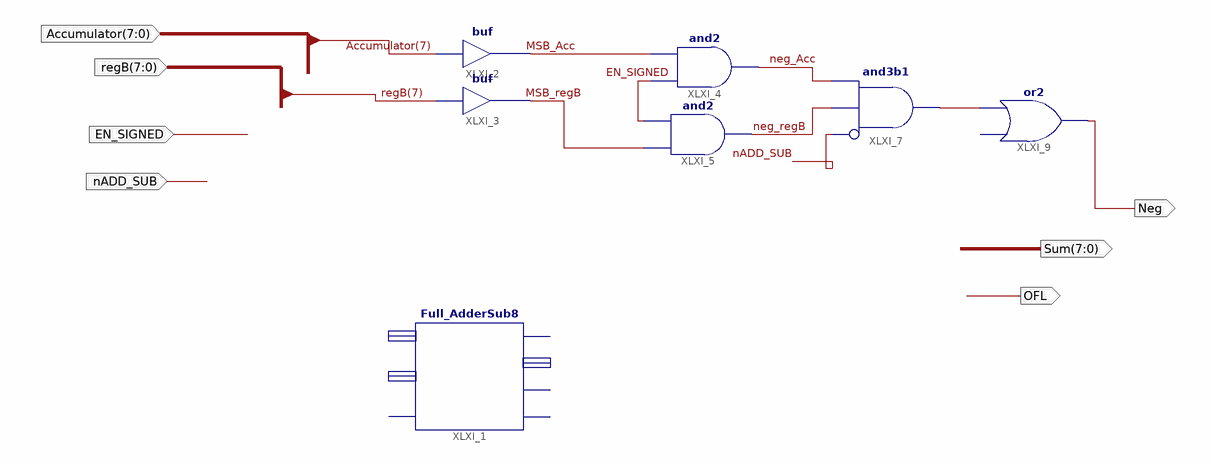
[diagram p0: schematic sheet 1]
// Xilinx ISE schematic ALU_Final.sch (spartan3e) as structural Verilog: 7 symbols, 7 ports
module ALU_Final (
  input  [7:0] Accumulator,
  input  [7:0] regB,
  input  EN_SIGNED,
  input  nADD_SUB,
  output [7:0] Sum,
  output Neg,
  output OFL
);

  wire MSB_Acc, MSB_regB, neg_Acc, neg_regB, XLXN_34;

  Full_AdderSub8 XLXI_1 ();  // open: Ain, Bin, nADD_SUB, Cout, Sum, Negative, OFL
  buf XLXI_2 (MSB_Acc, Accumulator[7]);
  buf XLXI_3 (MSB_regB, regB[7]);
  and XLXI_4 (neg_Acc, EN_SIGNED, MSB_Acc);
  and XLXI_5 (neg_regB, MSB_regB, EN_SIGNED);
  and XLXI_7 (XLXN_34, ~nADD_SUB, neg_regB, neg_Acc);  // and3b1
  buf XLXI_9 (Neg, XLXN_34);  // or2 open: I0
endmodule
